# EAGLE design microrelayblock_rev1 (EAGLE 7.1.0)
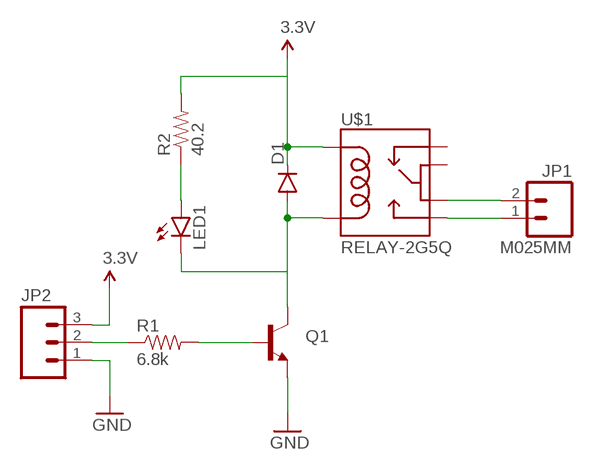
[diagram p0: schematic, sheet 1]

## Parts
D1  DIODESMA-KIT  [SMA-DIODE-KIT]
JP1  M025MM  [SCREWTERMINAL-5MM-2]
JP2  M03SCREW  [SCREWTERMINAL-3.5MM-3]
LED1  LED0603  [LED-0603]
Q1  TRANSISTOR_NPNSOT23  [SOT23]
R1  6.8k  RESISTOR0805-RES  [0805]
R2  40.2  RESISTOR0805-RES  [0805]
U$1  RELAY-2G5Q  [RELAY-G5V]

## Nets
3.3V: D1.C JP2.3 R2.2 U$1.2
GND: JP2.1 Q1.2(E)
N$1: Q1.1(B) R1.2
N$2: D1.A LED1.C Q1.3(C) U$1.9
N$3: JP1.1 U$1.10
N$4: JP1.2 U$1.6
N$5: LED1.A R2.1
N$6: JP2.2 R1.1
Unconnected: U$1.1 U$1.5

## Library data of the parts
D1 = SparkFun-DiscreteSemi:DIODE: Diode These are standard reverse protection diodes and small signal diodes. SMA package can handle up to about 1A. SOD-323 can handle about 200mA. What the SOD-323 package when ordering, there are some mfgs out there that are 5-pin packages.
JP1 = SparkFun-Connectors:M02: Standard 2-pin 0.1" header. Use with - straight break away headers ( PRT-00116) - right angle break away headers (PRT-00553) - swiss pins (PRT-00743) - machine pins (PRT-00117) - female headers (PRT-00115) Molex polarized connector foot print use with: PRT-08233 with associated crimp pins and housings. 2.54_SCREWTERM for use with PRT-10571. 3.5mm Screw Terminal footprints for PRT-08084 5mm Screw Terminal footprints for use with PRT-08433
JP2 = SparkFun-Connectors:M03: Header 3 Standard 3-pin 0.1" header. Use with straight break away headers (SKU : PRT-00116), right angle break away headers (PRT-00553), swiss pins (PRT-00743), machine pins (PRT-00117), and female headers (PRT-00115). Molex polarized connector foot print use with SKU : PRT-08232 with associated crimp pins and housings.
LED1 = SparkFun-LED:LED: LEDs Standard schematic elements and footprints for 5mm, 3mm, 1206, and 0603 sized LEDs. 5mm - Spark Fun Electronics SKU : COM-00529 (and others)
Q1 = SparkFun-DiscreteSemi:TRANSISTOR_NPN: Generic NPN BJT MMBT2222A - TRANS-08049 (SOT-23, 1A 40V) MPSA42 - TRANS-09116 (SOT-23, 500mA 300V) MMBT5088LT1G - TRANS-11160 (SOT-23, 50 mA 30V) BC547 - COM-08928 <http://www.sparkfun.com/products/8928> (TO-92 45V 100mA) (1.Collector 2.Base 3.Emitter) 2N3904 - COM-00521 <http://www.sparkfun.com/products/521> (TO-92 40V 200mA) (1.Emitter 2.Base 3.Collector) P2N2222A - COM-12852 <http://www.sparkfun.com/products/12852> (TO-92 40V 600mA) (1.Collector 2.Base 3.Emitter)
R1 R2 = SparkFun-Passives:RESISTOR: Resistor Basic schematic elements and footprints for 0603, 1206, and PTH resistors.
U$1 = SparkFun-Electromechanical:RELAY-2: SPDT relay (COM-00100)

## Board
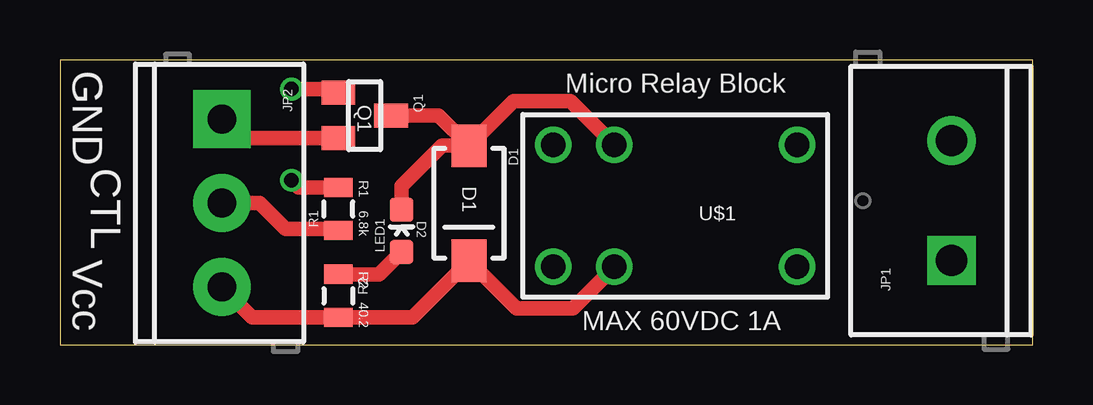
[diagram p1: board, top side]
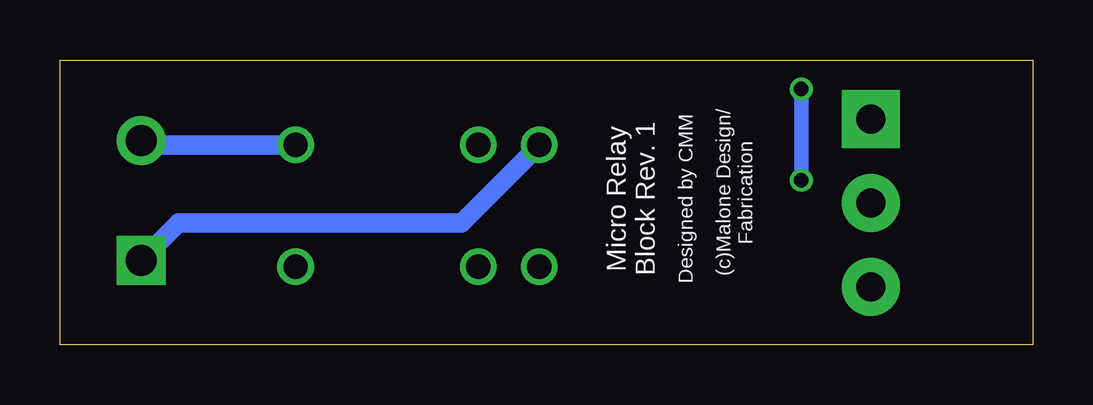
[diagram p2: board, bottom side, seen from below]

Size 40.55 x 11.88 mm. Coordinates in mm from the lower left corner, seen from the top.
Outline: 0,0 40.55,0 40.55,11.88 0,11.88 0,0
Copper layers (1*16): Top 0.0356mm / dielectric 1.5011mm / Bottom 0.0356mm
Design rules "LaenPCBOrder": minimum track width 6mil, minimum drill 13mil, track to track 6mil, track to pad 6mil, pad to pad 6mil, via to via 6mil, smd to smd 6mil, copper to edge 15mil, drill to drill 6mil, minimum pad ring 7mil, minimum via ring 7mil, stop-mask expansion 3mil, vias tented up to drill 0mil, thermal gap 10mil

### Footprints (pad centres in the part's own frame; a part is rotated, then mirrored left to right if it is on the bottom)
SMA-DIODE-KIT = smd 1.77 x 1.47: A -2.4,0; C 2.4,0
SCREWTERMINAL-5MM-2 = drill 1.3 pad 2.032 square: 1 0,0 | drill 1.3 pad 2.032: 2 5,0
SCREWTERMINAL-3.5MM-3 = drill 1.2 pad 2.413 square: 1 0,0 | drill 1.2 pad 2.413: 2 3.5,0; 3 7,0
LED-0603 = smd 1 x 1: A 0,-0.877; C 0,0.877
SOT23 = smd 1 x 1.4: 1 -0.95,-1.1; 2 0.95,-1.1; 3 0,1.1
0805 = smd 0.8 x 1.2: 1 -0.9,0; 2 0.9,0
RELAY-G5V = drill 1.016: 1 5.08,2.54; 2 2.54,2.54; 5 -5.08,2.54; 6 -5.08,-2.54; 9 2.54,-2.54; 10 5.08,-2.54

### Placement (x,y rotation side)
D1  17.05,5.9 270 top
JP1  37.17,3.51 90 top
JP2  6.75,9.41 270 top
LED1  14.24,4.75 0 top
Q1  12.7,9.56 270 top
R1  11.6,5.66 90 top
R2  11.6,2.04 270 top
U$1  25.65,5.79 180 top

### Tracks (layer width: path | path; a pad name or v marks a point on that pad's centre or on a via)
3.3V
  Top 0.61: JP2.3 8.02,1.14 R2.2 14.69,1.14 D1.C 19.03,1.52 21.38,1.52 U$1.2
GND
  Top 0.61: JP2.1 7.55,8.61 Q1.2
N$1  (via drill 0.6)
  Top 0.61: R1.2 9.95,6.56 v9.65,6.86 | v9.65,10.67 11.44,10.67 Q1.1
  Bottom 0.61: v9.65,6.86 v9.65,10.67
N$2
  Top 0.61: Q1.3 15.79,9.56 D1.A | LED1.C 14.24,6.62 15.92,8.3 D1.A | U$1.9 21.28,10.16 18.91,10.16 D1.A
N$3
  Bottom 0.813: U$1.10 23.82,5.08 35.6,5.08 JP1.1
N$4
  Bottom 0.813: U$1.6 36.99,8.33 JP1.2
N$5
  Top 0.61: R2.1 13.31,2.94 LED1.A
N$6
  Top 0.61: JP2.2 8.31,5.91 9.4,4.83 11.53,4.83 R1.1

### Text on the board
_tsilk: GND | Micro Relay Block | Q1 | CTL | R1 | D1 | 6.8k | D2 | Vcc | R2 | 40.2 | MAX 60VDC 1A
_bsilk: (c)Malone Design/ / Fabrication | Designed by CMM | Micro Relay / Block Rev. 1